# Altium schematic sheet 05 - Gate Drivers.SchDoc: Gate Drivers - 25kW WolfPACK FM3 Six-Pack Inv.
size 431 x 279 mm; Date: 09/2024; DocumentNumber: CRD25DA12N-FMC; Revision: 2.0; SheetNumber: 5; SheetTotal: 9; SheetSize: B
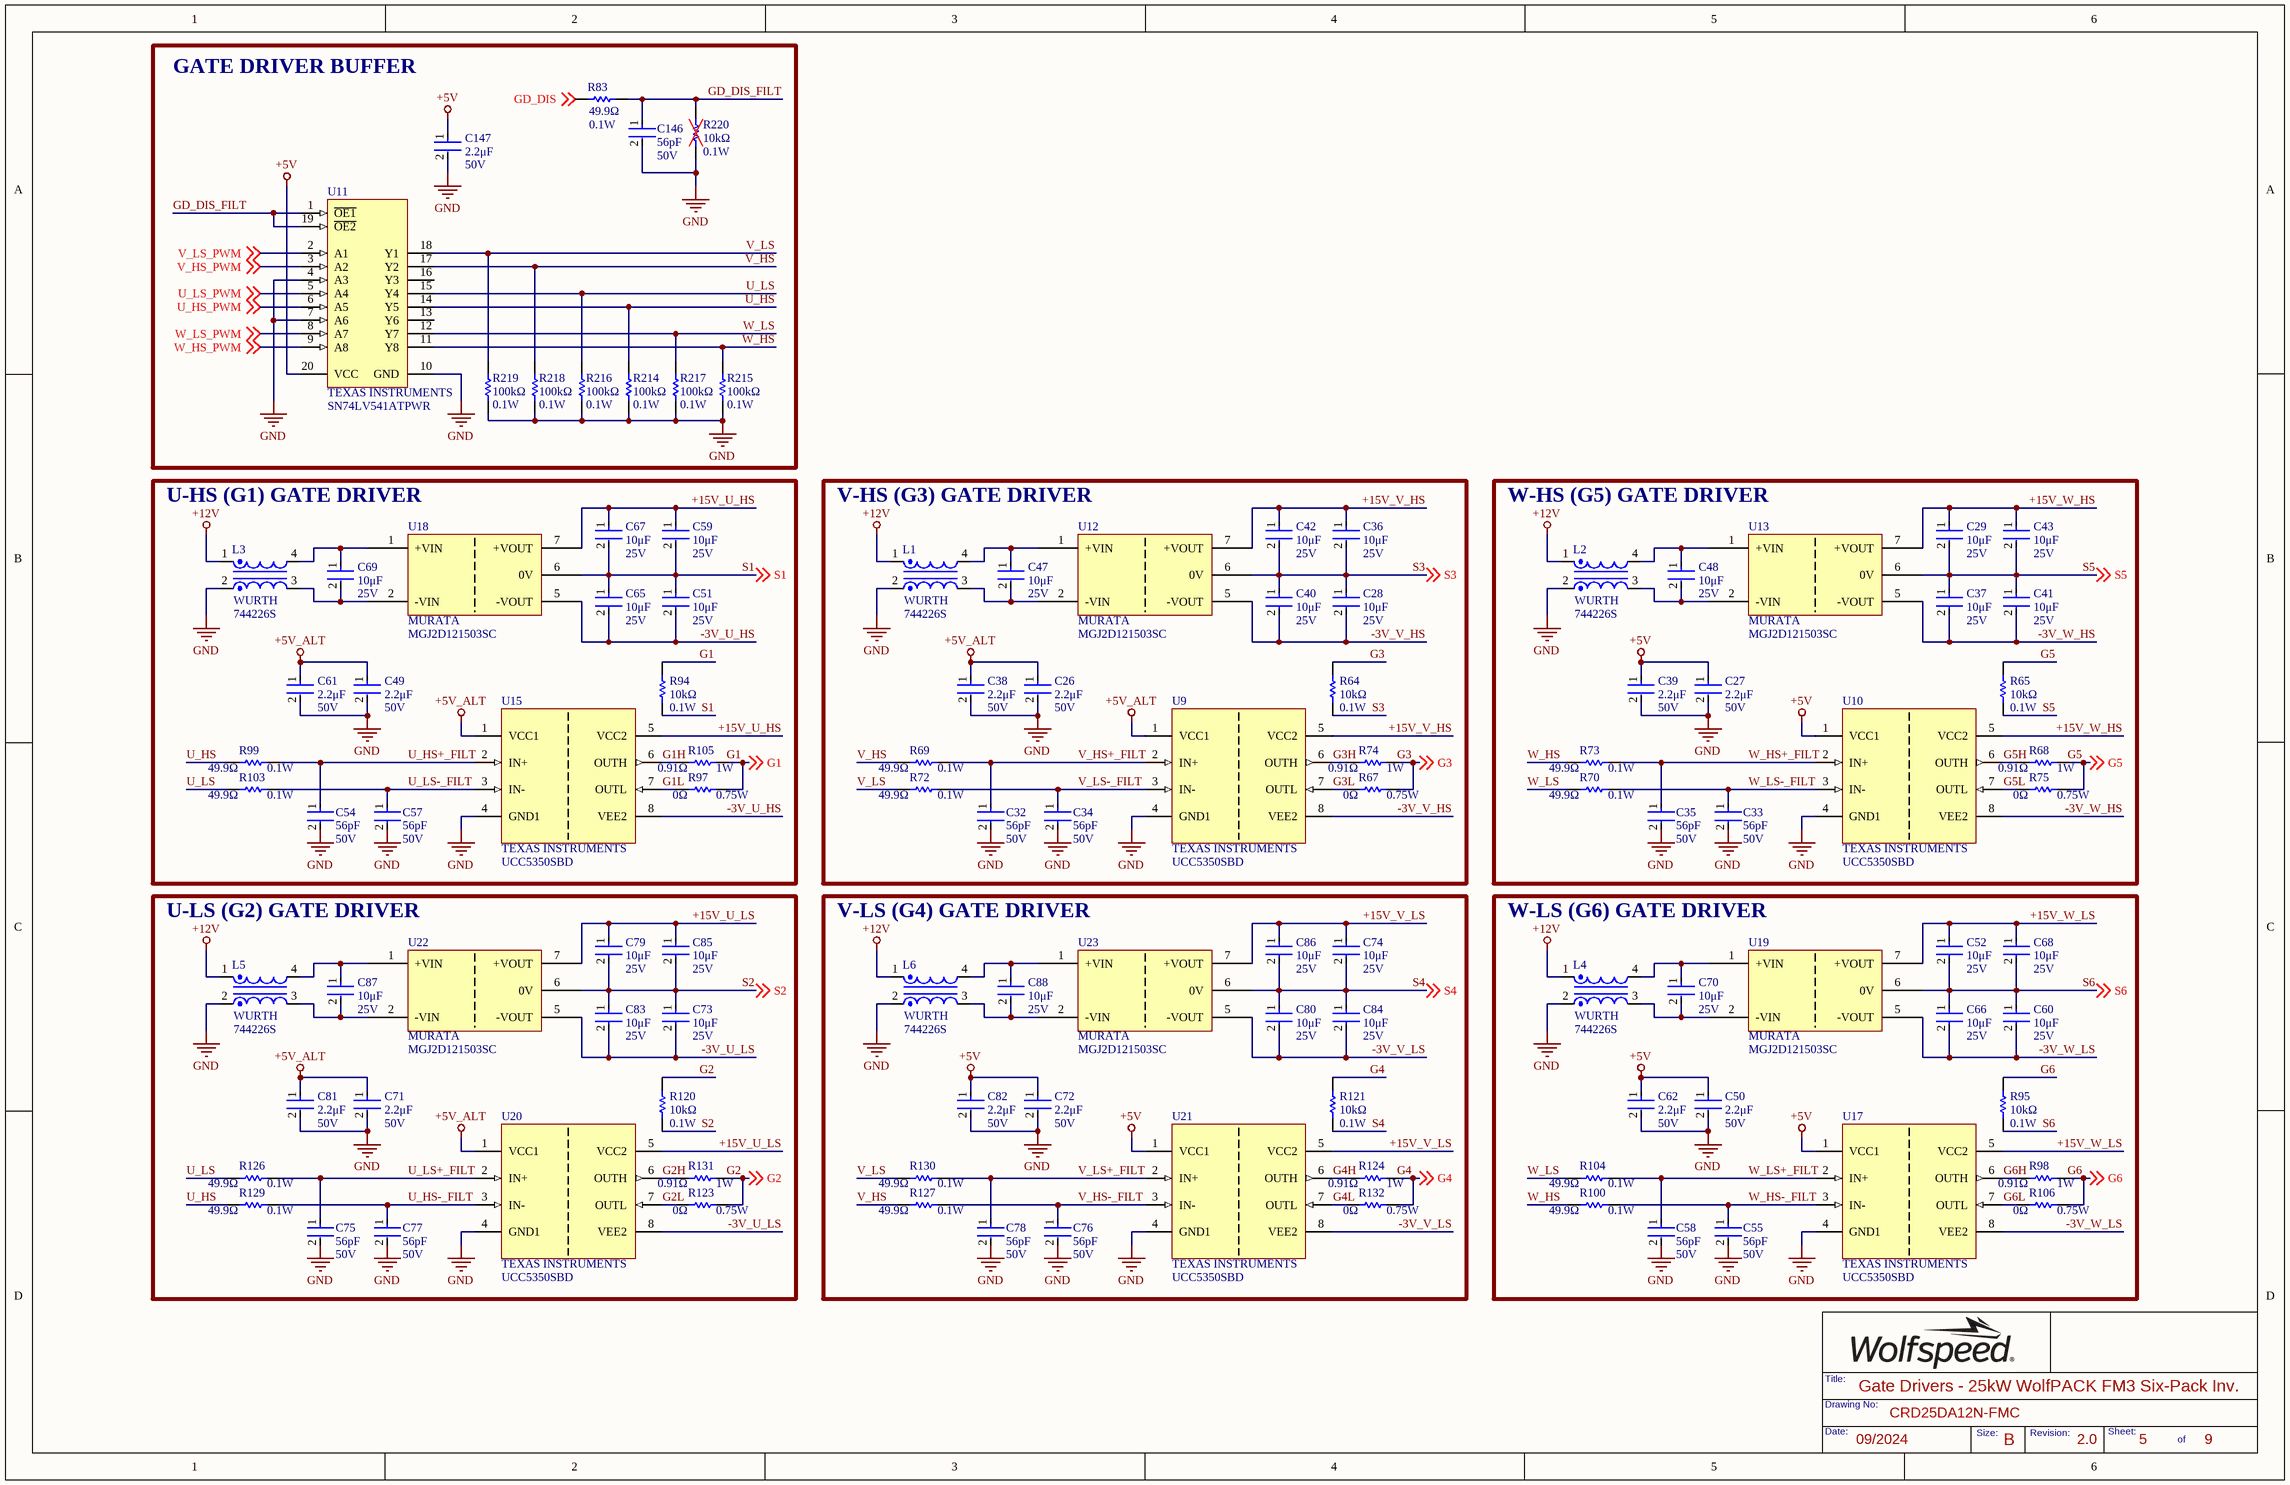
[diagram p0: 05 - Gate Drivers.SchDoc]

## Parts
C26  Voltage Rating: 50V  Capacitance: 2.2μF  [FP-C0603C-CF-IPC_B]  (hidden comment: GRT188R61H225ME13D)
C27  Voltage Rating: 50V  Capacitance: 2.2μF  [FP-C0603C-CF-IPC_B]  (hidden comment: GRT188R61H225ME13D)
C28  Voltage Rating: 25V  Capacitance: 10μF  [FP-CL31-IPC_B]  (hidden comment: CL31B106KAHSFNE)
C29  Voltage Rating: 25V  Capacitance: 10μF  [FP-CL31-IPC_B]  (hidden comment: CL31B106KAHSFNE)
C32  Capacitance: 56pF  Voltage Rating: 50V  [FP-C0603C-CF-IPC_B]  (hidden comment: CL10C560JB8NNNC)
C33  Capacitance: 56pF  Voltage Rating: 50V  [FP-C0603C-CF-IPC_B]  (hidden comment: CL10C560JB8NNNC)
C34  Capacitance: 56pF  Voltage Rating: 50V  [FP-C0603C-CF-IPC_B]  (hidden comment: CL10C560JB8NNNC)
C35  Capacitance: 56pF  Voltage Rating: 50V  [FP-C0603C-CF-IPC_B]  (hidden comment: CL10C560JB8NNNC)
C36  Voltage Rating: 25V  Capacitance: 10μF  [FP-CL31-IPC_B]  (hidden comment: CL31B106KAHSFNE)
C37  Voltage Rating: 25V  Capacitance: 10μF  [FP-CL31-IPC_B]  (hidden comment: CL31B106KAHSFNE)
C38  Voltage Rating: 50V  Capacitance: 2.2μF  [FP-C0603C-CF-IPC_B]  (hidden comment: GRT188R61H225ME13D)
C39  Voltage Rating: 50V  Capacitance: 2.2μF  [FP-C0603C-CF-IPC_B]  (hidden comment: GRT188R61H225ME13D)
C40  Voltage Rating: 25V  Capacitance: 10μF  [FP-CL31-IPC_B]  (hidden comment: CL31B106KAHSFNE)
C41  Voltage Rating: 25V  Capacitance: 10μF  [FP-CL31-IPC_B]  (hidden comment: CL31B106KAHSFNE)
C42  Voltage Rating: 25V  Capacitance: 10μF  [FP-CL31-IPC_B]  (hidden comment: CL31B106KAHSFNE)
C43  Voltage Rating: 25V  Capacitance: 10μF  [FP-CL31-IPC_B]  (hidden comment: CL31B106KAHSFNE)
C47  Voltage Rating: 25V  Capacitance: 10μF  [FP-CL31-IPC_B]  (hidden comment: CL31B106KAHSFNE)
C48  Voltage Rating: 25V  Capacitance: 10μF  [FP-CL31-IPC_B]  (hidden comment: CL31B106KAHSFNE)
C49  Voltage Rating: 50V  Capacitance: 2.2μF  [FP-C0603C-CF-IPC_B]  (hidden comment: GRT188R61H225ME13D)
C50  Voltage Rating: 50V  Capacitance: 2.2μF  [FP-C0603C-CF-IPC_B]  (hidden comment: GRT188R61H225ME13D)
C51  Voltage Rating: 25V  Capacitance: 10μF  [FP-CL31-IPC_B]  (hidden comment: CL31B106KAHSFNE)
C52  Voltage Rating: 25V  Capacitance: 10μF  [FP-CL31-IPC_B]  (hidden comment: CL31B106KAHSFNE)
C54  Capacitance: 56pF  Voltage Rating: 50V  [FP-C0603C-CF-IPC_B]  (hidden comment: CL10C560JB8NNNC)
C55  Capacitance: 56pF  Voltage Rating: 50V  [FP-C0603C-CF-IPC_B]  (hidden comment: CL10C560JB8NNNC)
C57  Capacitance: 56pF  Voltage Rating: 50V  [FP-C0603C-CF-IPC_B]  (hidden comment: CL10C560JB8NNNC)
C58  Capacitance: 56pF  Voltage Rating: 50V  [FP-C0603C-CF-IPC_B]  (hidden comment: CL10C560JB8NNNC)
C59  Voltage Rating: 25V  Capacitance: 10μF  [FP-CL31-IPC_B]  (hidden comment: CL31B106KAHSFNE)
C60  Voltage Rating: 25V  Capacitance: 10μF  [FP-CL31-IPC_B]  (hidden comment: CL31B106KAHSFNE)
C61  Voltage Rating: 50V  Capacitance: 2.2μF  [FP-C0603C-CF-IPC_B]  (hidden comment: GRT188R61H225ME13D)
C62  Voltage Rating: 50V  Capacitance: 2.2μF  [FP-C0603C-CF-IPC_B]  (hidden comment: GRT188R61H225ME13D)
C65  Voltage Rating: 25V  Capacitance: 10μF  [FP-CL31-IPC_B]  (hidden comment: CL31B106KAHSFNE)
C66  Voltage Rating: 25V  Capacitance: 10μF  [FP-CL31-IPC_B]  (hidden comment: CL31B106KAHSFNE)
C67  Voltage Rating: 25V  Capacitance: 10μF  [FP-CL31-IPC_B]  (hidden comment: CL31B106KAHSFNE)
C68  Voltage Rating: 25V  Capacitance: 10μF  [FP-CL31-IPC_B]  (hidden comment: CL31B106KAHSFNE)
C69  Voltage Rating: 25V  Capacitance: 10μF  [FP-CL31-IPC_B]  (hidden comment: CL31B106KAHSFNE)
C70  Voltage Rating: 25V  Capacitance: 10μF  [FP-CL31-IPC_B]  (hidden comment: CL31B106KAHSFNE)
C71  Voltage Rating: 50V  Capacitance: 2.2μF  [FP-C0603C-CF-IPC_B]  (hidden comment: GRT188R61H225ME13D)
C72  Voltage Rating: 50V  Capacitance: 2.2μF  [FP-C0603C-CF-IPC_B]  (hidden comment: GRT188R61H225ME13D)
C73  Voltage Rating: 25V  Capacitance: 10μF  [FP-CL31-IPC_B]  (hidden comment: CL31B106KAHSFNE)
C74  Voltage Rating: 25V  Capacitance: 10μF  [FP-CL31-IPC_B]  (hidden comment: CL31B106KAHSFNE)
C75  Capacitance: 56pF  Voltage Rating: 50V  [FP-C0603C-CF-IPC_B]  (hidden comment: CL10C560JB8NNNC)
C76  Capacitance: 56pF  Voltage Rating: 50V  [FP-C0603C-CF-IPC_B]  (hidden comment: CL10C560JB8NNNC)
C77  Capacitance: 56pF  Voltage Rating: 50V  [FP-C0603C-CF-IPC_B]  (hidden comment: CL10C560JB8NNNC)
C78  Capacitance: 56pF  Voltage Rating: 50V  [FP-C0603C-CF-IPC_B]  (hidden comment: CL10C560JB8NNNC)
C79  Voltage Rating: 25V  Capacitance: 10μF  [FP-CL31-IPC_B]  (hidden comment: CL31B106KAHSFNE)
C80  Voltage Rating: 25V  Capacitance: 10μF  [FP-CL31-IPC_B]  (hidden comment: CL31B106KAHSFNE)
C81  Voltage Rating: 50V  Capacitance: 2.2μF  [FP-C0603C-CF-IPC_B]  (hidden comment: GRT188R61H225ME13D)
C82  Voltage Rating: 50V  Capacitance: 2.2μF  [FP-C0603C-CF-IPC_B]  (hidden comment: GRT188R61H225ME13D)
C83  Voltage Rating: 25V  Capacitance: 10μF  [FP-CL31-IPC_B]  (hidden comment: CL31B106KAHSFNE)
C84  Voltage Rating: 25V  Capacitance: 10μF  [FP-CL31-IPC_B]  (hidden comment: CL31B106KAHSFNE)
C85  Voltage Rating: 25V  Capacitance: 10μF  [FP-CL31-IPC_B]  (hidden comment: CL31B106KAHSFNE)
C86  Voltage Rating: 25V  Capacitance: 10μF  [FP-CL31-IPC_B]  (hidden comment: CL31B106KAHSFNE)
C87  Voltage Rating: 25V  Capacitance: 10μF  [FP-CL31-IPC_B]  (hidden comment: CL31B106KAHSFNE)
C88  Voltage Rating: 25V  Capacitance: 10μF  [FP-CL31-IPC_B]  (hidden comment: CL31B106KAHSFNE)
C146  Capacitance: 56pF  Voltage Rating: 50V  [FP-C0603C-CF-IPC_B]  (hidden comment: CL10C560JB8NNNC)
C147  Voltage Rating: 50V  Capacitance: 2.2μF  [FP-C0603C-CF-IPC_B]  (hidden comment: GRT188R61H225ME13D)
L1  744226S  Manufacturer Print: WURTH  [WE-SL2]
L2  744226S  Manufacturer Print: WURTH  [WE-SL2]
L3  744226S  Manufacturer Print: WURTH  [WE-SL2]
L4  744226S  Manufacturer Print: WURTH  [WE-SL2]
L5  744226S  Manufacturer Print: WURTH  [WE-SL2]
L6  744226S  Manufacturer Print: WURTH  [WE-SL2]
R64  Resistance: 10kΩ  Max Power Dissipation: 0.1W  [FP-MCR03-IPC_B]  (hidden comment: ERJ3EKF1002V)
R65  Resistance: 10kΩ  Max Power Dissipation: 0.1W  [FP-MCR03-IPC_B]  (hidden comment: ERJ3EKF1002V)
R67  value 0Ω  Power Rating: 0.75W  [RESC3125X70X40NL20T20]  (hidden comment: CRCW12100000Z0EAHP)
R68  value 0.91Ω  Power: 1W  [RESC3125X70X40NL20T20]  (hidden comment: RCWE1210R910FKEA)
R69  Resistance: 49.9Ω  Power Rating: 0.1W  [FP-MCR03-IPC_B]  (hidden comment: ERJ-3EKF49R9V)
R70  Resistance: 49.9Ω  Power Rating: 0.1W  [FP-MCR03-IPC_B]  (hidden comment: ERJ-3EKF49R9V)
R72  Resistance: 49.9Ω  Power Rating: 0.1W  [FP-MCR03-IPC_B]  (hidden comment: ERJ-3EKF49R9V)
R73  Resistance: 49.9Ω  Power Rating: 0.1W  [FP-MCR03-IPC_B]  (hidden comment: ERJ-3EKF49R9V)
R74  value 0.91Ω  Power: 1W  [RESC3125X70X40NL20T20]  (hidden comment: RCWE1210R910FKEA)
R75  value 0Ω  Power Rating: 0.75W  [RESC3125X70X40NL20T20]  (hidden comment: CRCW12100000Z0EAHP)
R83  Resistance: 49.9Ω  Power Rating: 0.1W  [FP-MCR03-IPC_B]  (hidden comment: ERJ-3EKF49R9V)
R94  Resistance: 10kΩ  Max Power Dissipation: 0.1W  [FP-MCR03-IPC_B]  (hidden comment: ERJ3EKF1002V)
R95  Resistance: 10kΩ  Max Power Dissipation: 0.1W  [FP-MCR03-IPC_B]  (hidden comment: ERJ3EKF1002V)
R97  value 0Ω  Power Rating: 0.75W  [RESC3125X70X40NL20T20]  (hidden comment: CRCW12100000Z0EAHP)
R98  value 0.91Ω  Power: 1W  [RESC3125X70X40NL20T20]  (hidden comment: RCWE1210R910FKEA)
R99  Resistance: 49.9Ω  Power Rating: 0.1W  [FP-MCR03-IPC_B]  (hidden comment: ERJ-3EKF49R9V)
R100  Resistance: 49.9Ω  Power Rating: 0.1W  [FP-MCR03-IPC_B]  (hidden comment: ERJ-3EKF49R9V)
R103  Resistance: 49.9Ω  Power Rating: 0.1W  [FP-MCR03-IPC_B]  (hidden comment: ERJ-3EKF49R9V)
R104  Resistance: 49.9Ω  Power Rating: 0.1W  [FP-MCR03-IPC_B]  (hidden comment: ERJ-3EKF49R9V)
R105  value 0.91Ω  Power: 1W  [RESC3125X70X40NL20T20]  (hidden comment: RCWE1210R910FKEA)
R106  value 0Ω  Power Rating: 0.75W  [RESC3125X70X40NL20T20]  (hidden comment: CRCW12100000Z0EAHP)
R120  Resistance: 10kΩ  Max Power Dissipation: 0.1W  [FP-MCR03-IPC_B]  (hidden comment: ERJ3EKF1002V)
R121  Resistance: 10kΩ  Max Power Dissipation: 0.1W  [FP-MCR03-IPC_B]  (hidden comment: ERJ3EKF1002V)
R123  value 0Ω  Power Rating: 0.75W  [RESC3125X70X40NL20T20]  (hidden comment: CRCW12100000Z0EAHP)
R124  value 0.91Ω  Power: 1W  [RESC3125X70X40NL20T20]  (hidden comment: RCWE1210R910FKEA)
R126  Resistance: 49.9Ω  Power Rating: 0.1W  [FP-MCR03-IPC_B]  (hidden comment: ERJ-3EKF49R9V)
R127  Resistance: 49.9Ω  Power Rating: 0.1W  [FP-MCR03-IPC_B]  (hidden comment: ERJ-3EKF49R9V)
R129  Resistance: 49.9Ω  Power Rating: 0.1W  [FP-MCR03-IPC_B]  (hidden comment: ERJ-3EKF49R9V)
R130  Resistance: 49.9Ω  Power Rating: 0.1W  [FP-MCR03-IPC_B]  (hidden comment: ERJ-3EKF49R9V)
R131  value 0.91Ω  Power: 1W  [RESC3125X70X40NL20T20]  (hidden comment: RCWE1210R910FKEA)
R132  value 0Ω  Power Rating: 0.75W  [RESC3125X70X40NL20T20]  (hidden comment: CRCW12100000Z0EAHP)
R214  Resistance: 100kΩ  Power Rating: 0.1W  [FP-MCR03-IPC_B]  (hidden comment: RC0603FR-07100KL)
R215  Resistance: 100kΩ  Power Rating: 0.1W  [FP-MCR03-IPC_B]  (hidden comment: RC0603FR-07100KL)
R216  Resistance: 100kΩ  Power Rating: 0.1W  [FP-MCR03-IPC_B]  (hidden comment: RC0603FR-07100KL)
R217  Resistance: 100kΩ  Power Rating: 0.1W  [FP-MCR03-IPC_B]  (hidden comment: RC0603FR-07100KL)
R218  Resistance: 100kΩ  Power Rating: 0.1W  [FP-MCR03-IPC_B]  (hidden comment: RC0603FR-07100KL)
R219  Resistance: 100kΩ  Power Rating: 0.1W  [FP-MCR03-IPC_B]  (hidden comment: RC0603FR-07100KL)
R220  Resistance: 10kΩ  Max Power Dissipation: 0.1W  [FP-MCR03-IPC_B]  (hidden comment: ERJ3EKF1002V)
U9  UCC5350SBD  Manufacturer Print: TEXAS INSTRUMENTS  [D0008B_HV]
U10  UCC5350SBD  Manufacturer Print: TEXAS INSTRUMENTS  [D0008B_HV]
U11  Manufacturer: TEXAS INSTRUMENTS  [PW0020A_L]  (hidden comment: SN74LV541ATPWR)
U12  MGJ2D121503SC  Manufacturer Print: MURATA  [MGJ2D121509SC]
U13  MGJ2D121503SC  Manufacturer Print: MURATA  [MGJ2D121509SC]
U15  UCC5350SBD  Manufacturer Print: TEXAS INSTRUMENTS  [D0008B_HV]
U17  UCC5350SBD  Manufacturer Print: TEXAS INSTRUMENTS  [D0008B_HV]
U18  MGJ2D121503SC  Manufacturer Print: MURATA  [MGJ2D121509SC]
U19  MGJ2D121503SC  Manufacturer Print: MURATA  [MGJ2D121509SC]
U20  UCC5350SBD  Manufacturer Print: TEXAS INSTRUMENTS  [D0008B_HV]
U21  UCC5350SBD  Manufacturer Print: TEXAS INSTRUMENTS  [D0008B_HV]
U22  MGJ2D121503SC  Manufacturer Print: MURATA  [MGJ2D121509SC]
U23  MGJ2D121503SC  Manufacturer Print: MURATA  [MGJ2D121509SC]

## Blocks framed on the sheet
GATE DRIVER BUFFER: C146 C147 R83 R214-R220 U11
U-HS (G1) GATE DRIVER: C49 C51 C54 C57 C59 C61 C65 C67 C69 L3 R94 R97 R99 R103 R105 U15 U18
V-HS (G3) GATE DRIVER: C26 C28 C32 C34 C36 C38 C40 C42 C47 L1 R64 R67 R69 R72 R74 U9 U12
W-HS (G5) GATE DRIVER: C27 C29 C33 C35 C37 C39 C41 C43 C48 L2 R65 R68 R70 R73 R75 U10 U13
U-LS (G2) GATE DRIVER: C71 C73 C75 C77 C79 C81 C83 C85 C87 L5 R120 R123 R126 R129 R131 U20 U22
V-LS (G4) GATE DRIVER: C72 C74 C76 C78 C80 C82 C84 C86 C88 L6 R121 R124 R127 R130 R132 U21 U23
W-LS (G6) GATE DRIVER: C50 C52 C55 C58 C60 C62 C66 C68 C70 L4 R95 R98 R100 R104 R106 U17 U19

## Nets
+5V: C27.1 C39.1 C50.1 C62.1 C72.1 C82.1 C147.1 U10.1(VCC1) U11.20(VCC) U17.1(VCC1) U21.1(VCC1)
+5V_ALT: C26.1 C38.1 C49.1 C61.1 C71.1 C81.1 U9.1(VCC1) U15.1(VCC1) U20.1(VCC1)
+12V: L1.1 L2.1 L3.1 L4.1 L5.1 L6.1
GND: C26.2 C27.2 C32.2 C33.2 C34.2 C35.2 C38.2 C39.2 C49.2 C50.2 C54.2 C55.2 C57.2 C58.2 C61.2 C62.2 C71.2 C72.2 C75.2 C76.2 C77.2 C78.2 C81.2 C82.2 C146.2 C147.2 L1.2 L2.2 L3.2 L4.2 L5.2 L6.2 R214.1 R215.1 R216.1 R217.1 R218.1 R219.1 R220.1 U9.4(GND1) U10.4(GND1) U11.4(A3) U11.7(A6) U11.10(GND) U15.4(GND1) U17.4(GND1) U20.4(GND1) U21.4(GND1)
+15V_U_HS: C59.1 C67.1 U15.5(VCC2) U18.7(+VOUT)
+15V_U_LS: C79.1 C85.1 U20.5(VCC2) U22.7(+VOUT)
+15V_V_HS: C36.1 C42.1 U9.5(VCC2) U12.7(+VOUT)
+15V_V_LS: C74.1 C86.1 U21.5(VCC2) U23.7(+VOUT)
+15V_W_HS: C29.1 C43.1 U10.5(VCC2) U13.7(+VOUT)
+15V_W_LS: C52.1 C68.1 U17.5(VCC2) U19.7(+VOUT)
-3V_U_HS: C51.2 C65.2 U15.8(VEE2) U18.5(-VOUT)
-3V_U_LS: C73.2 C83.2 U20.8(VEE2) U22.5(-VOUT)
-3V_V_HS: C28.2 C40.2 U9.8(VEE2) U12.5(-VOUT)
-3V_V_LS: C80.2 C84.2 U21.8(VEE2) U23.5(-VOUT)
-3V_W_HS: C37.2 C41.2 U10.8(VEE2) U13.5(-VOUT)
-3V_W_LS: C60.2 C66.2 U17.8(VEE2) U19.5(-VOUT)
G1: R94.2 R97.2 R105.2 ; off-sheet G1
G1H: R105.1 U15.6(OUTH)
G1L: R97.1 U15.7(OUTL)
G2: R120.2 R123.2 R131.2 ; off-sheet G2
G2H: R131.1 U20.6(OUTH)
G2L: R123.1 U20.7(OUTL)
G3: R64.2 R67.2 R74.2 ; off-sheet G3
G3H: R74.1 U9.6(OUTH)
G3L: R67.1 U9.7(OUTL)
G4: R121.2 R124.2 R132.2 ; off-sheet G4
G4H: R124.1 U21.6(OUTH)
G4L: R132.1 U21.7(OUTL)
G5: R65.2 R68.2 R75.2 ; off-sheet G5
G5H: R68.1 U10.6(OUTH)
G5L: R75.1 U10.7(OUTL)
G6: R95.2 R98.2 R106.2 ; off-sheet G6
G6H: R98.1 U17.6(OUTH)
G6L: R106.1 U17.7(OUTL)
GD_DIS: R83.1 ; off-sheet GD_DIS
GD_DIS_FILT: C146.1 R83.2 R220.2 U11.1(~{OE1}) U11.19(~{OE2})
S1: C51.1 C59.2 C65.1 C67.2 R94.1 U18.6(0V) ; off-sheet S1
S2: C73.1 C79.2 C83.1 C85.2 R120.1 U22.6(0V) ; off-sheet S2
S3: C28.1 C36.2 C40.1 C42.2 R64.1 U12.6(0V) ; off-sheet S3
S4: C74.2 C80.1 C84.1 C86.2 R121.1 U23.6(0V) ; off-sheet S4
S5: C29.2 C37.1 C41.1 C43.2 R65.1 U13.6(0V) ; off-sheet S5
S6: C52.2 C60.1 C66.1 C68.2 R95.1 U19.6(0V) ; off-sheet S6
U_HS: R99.1 R129.1 R214.2 U11.14(Y5)
U_HS+_FILT: C54.1 R99.2 U15.2(IN+)
U_HS-_FILT: C77.1 R129.2 U20.3(IN-)
U_HS_PWM: U11.6(A5) ; off-sheet U_HS_PWM
U_LS: R103.1 R126.1 R216.2 U11.15(Y4)
U_LS+_FILT: C75.1 R126.2 U20.2(IN+)
U_LS-_FILT: C57.1 R103.2 U15.3(IN-)
U_LS_PWM: U11.5(A4) ; off-sheet U_LS_PWM
V_HS: R69.1 R127.1 R218.2 U11.17(Y2)
V_HS+_FILT: C32.1 R69.2 U9.2(IN+)
V_HS-_FILT: C76.1 R127.2 U21.3(IN-)
V_HS_PWM: U11.3(A2) ; off-sheet V_HS_PWM
V_LS: R72.1 R130.1 R219.2 U11.18(Y1)
V_LS+_FILT: C78.1 R130.2 U21.2(IN+)
V_LS-_FILT: C34.1 R72.2 U9.3(IN-)
V_LS_PWM: U11.2(A1) ; off-sheet V_LS_PWM
W_HS: R73.1 R100.1 R215.2 U11.11(Y8)
W_HS+_FILT: C35.1 R73.2 U10.2(IN+)
W_HS-_FILT: C55.1 R100.2 U17.3(IN-)
W_HS_PWM: U11.9(A8) ; off-sheet W_HS_PWM
W_LS: R70.1 R104.1 R217.2 U11.12(Y7)
W_LS+_FILT: C58.1 R104.2 U17.2(IN+)
W_LS-_FILT: C33.1 R70.2 U10.3(IN-)
W_LS_PWM: U11.8(A7) ; off-sheet W_LS_PWM
NetC47_1: C47.1 L1.4 U12.1(+VIN)
NetC47_2: C47.2 L1.3 U12.2(-VIN)
NetC48_1: C48.1 L2.4 U13.1(+VIN)
NetC48_2: C48.2 L2.3 U13.2(-VIN)
NetC69_1: C69.1 L3.4 U18.1(+VIN)
NetC69_2: C69.2 L3.3 U18.2(-VIN)
NetC70_1: C70.1 L4.4 U19.1(+VIN)
NetC70_2: C70.2 L4.3 U19.2(-VIN)
NetC87_1: C87.1 L5.4 U22.1(+VIN)
NetC87_2: C87.2 L5.3 U22.2(-VIN)
NetC88_1: C88.1 L6.4 U23.1(+VIN)
NetC88_2: C88.2 L6.3 U23.2(-VIN)

Not connected (* = marked no-connect by the designer): U11 13(Y6) 16(Y3)

## Notes on the sheet
- Title:
- Date:
- Drawing No:
- Size:
- Revision:
- Sheet:
- of

## Library data of the parts
C26 C27 C38 C39 C49 C50 C61 C62 C71 C72 C81 C82 C147 = GRT188R61H225ME13D: CAP CER 2.2UF 50V X5R 0603; Manufacturer: MURATA; Tolerance: 20%; Value: 2.2μF; Supplier 1: Arrow Electronics; Manufacturer Part Number: GRT188R61H225ME13D; RoHS: Yes; Category: Ceramic Capacitors; Stock 1: 3937; Pricing 1: 1=0.29580, 10=0.20370, 25=0.18090, 100=0.12380, 250=0.12190, 500=0.10920, 1000=0.07700, 3000=0.07630 (USD); Mount: Surface Mount; Case Code (Metric): 1608; Case Code (Imperial): 0603; Min Operating Temperature: -55°C; Max Operating Temperature: 85°C; Packaging: Tape and Reel; Length: 0.063inch; Width: 0.031inch; Thickness: 0.035inch; Ratings: AEC-Q200; RoHS Compliant: Yes; ComponentLink1URL: http://search.murata.co.jp/Ceramy/image/img/A01X/G101/ENG/GRT188R61H225ME13-01.pdf?src-supplier=Digi-Key; ComponentLink1Description: http://search.murata.co.jp/Ceramy/image/img/A01X/G101/ENG/GRT188R61H225ME13-01.pdf?src-supplier=Digi-Key; ComponentLink2URL: https://search.murata.co.jp/Ceramy/image/img/A01X/G101/ENG/GRT188R61H225ME13-01.pdf?src-supplier=Digi-Key; ComponentLink2Description: https://search.murata.co.jp/Ceramy/image/img/A01X/G101/ENG/GRT188R61H225ME13-01.pdf?src-supplier=Digi-Key; Supplier Part Number 1: GRT188R61H225ME13D; Package: 0603
C28 C29 C36 C37 C40-C43 C47 C48 C51 C52 C59 C60 C65-C70 C73 C74 C79 C80 C83-C88 = CMP-13271-001434-1: CAP CER 10UF 25V X7R 1206; Manufacturer: SAMSUNG; Tolerance: 10%; Value: 10μF; Max Operating Temperature: 125°C; Dielectric: X7R; Min Operating Temperature: -55°C; Height: 1.6mm; Mount: Surface Mount; Width: 0.063inch; Thickness: 0.071inch; Case Code (Metric): 3216; Contact Plating: Tin; Packaging: Tape and Reel; Package: 1206; Case Code (Imperial): 1206; Length: 0.126inch; Radiation Hardening: No; Package Quantity: 1; Depth: 1.6mm; Manufacturer Part Number: CL31B106KAHSFNE
C32-C35 C54 C55 C57 C58 C75-C78 C146 = CL10C560JB8NNNC: CAP CER 56PF 50V C0G/NP0 0603; Manufacturer: SAMSUNG; Material: Ceramic; Tolerance: 5%; Dielectric: C0G; Temperature Coefficient: 30ppm/°C; Supplier 1: Arrow Electronics; Manufacturer Part Number: CL10C560JB8NNNC; RoHS: Yes; Category: Ceramic Capacitors; Stock 1: 60182; Pricing 1: 1=0.05960, 10=0.01370, 25=0.01360, 100=0.01080, 250=0.01070, 500=0.00740, 1000=0.00590, 3000=0.00560, 6000=0.00530, 15000=0.00500, 30000=0.00470 (USD); Mount: Surface Mount; Case Code (Metric): 1608; Case Code (Imperial): 0603; Min Operating Temperature: -55°C; Max Operating Temperature: 125°C; Packaging: Tape and Reel; Package Quantity: 1; Voltage: 50V; Voltage Rating (DC): 50V; Series: CL; Construction: Flat; Termination: SMD/SMT; Length: 1.6mm; Width: 0.031inch; Height: 0.8mm; Thickness: 0.035inch; Depth: 0.8mm; Radiation Hardening: No; Lead Free: Lead Free; RoHS Compliant: Yes; ComponentLink1URL: https://datasheet.ciiva.com/25803/cl10c560jb8nnnc-25803592.pdf?src-supplier=Digi-Key; ComponentLink1Description: https://datasheet.ciiva.com/25803/cl10c560jb8nnnc-25803592.pdf?src-supplier=Digi-Key; ComponentLink2URL: https://datasheet.ciiva.com/26838/getdatasheetpartid-640760-26838546.pdf?src-supplier=Verical; ComponentLink2Description: https://datasheet.ciiva.com/26838/getdatasheetpartid-640760-26838546.pdf?src-supplier=Verical; ComponentLink3URL: https://datasheet.ciiva.com/29198/456837-da-01-en-vs-kondensator-0603-29198873.pdf?src-supplier=Conrad; ComponentLink3Description: https://datasheet.ciiva.com/29198/456837-da-01-en-vs-kondensator-0603-29198873.pdf?src-supplier=Conrad; ComponentLink4URL: https://datasheet.ciiva.com/48428/mlcc-catalogdownload2013-eng-48428598.pdf?src-supplier=Distrelec; ComponentLink4Description: https://datasheet.ciiva.com/48428/mlcc-catalogdownload2013-eng-48428598.pdf?src-supplier=Distrelec; ComponentLink5URL: https://datasheet.ciiva.com/16449/cl05b104kq5nnnc-16449527.pdf?src-supplier=Future+Electronics; ComponentLink5Description: https://datasheet.ciiva.com/16449/cl05b104kq5nnnc-16449527.pdf?src-supplier=Future+Electronics; Supplier Part Number 1: CL10C560JB8NNNC; Package: 0603; Value: 56pF
L1-L6 = 744226S: CMC 10UH 1.6A 2LN 920 OHM SMD; Manufacturer: WURTH ELECTRONIK; Tolerance: 30%; Voltage Rating: 80V; Resistance: 80mR; Impedance: 920R; Number of Lines: 2; Test Frequency: 1kHz; Value: 10μH; Supplier 1: Rs; Manufacturer Part Number: 744226S; RoHS: Yes; Category: Common Mode Chokes; Stock 1: 1; Pricing 1: 1=2.59000, 25=2.28200, 100=2.10000, 250=1.94000, 500=1.81400 (USD); Mount: Surface Mount; Case/Package: SMD/SMT; Weight: 0.017672oz; Min Operating Temperature: -40°C; Max Operating Temperature: 125°C; Packaging: Tape and Reel; Package Quantity: 1; Series: WE-SL2; Termination: SMD/SMT; Current Rating: 1.6A; Inductance: 10uH; Current: 1.6A; DC Resistance (DCR): 80mR; Max DC Current: 1.6A; Max Current Rating: 1.6A; Length: 9.2mm; Width: 6mm; Height: 0.205inch; Lead Free: Lead Free; RoHS Compliant: Yes; Reach SVHC Compliant: Yes; ComponentLink1URL: https://datasheet.ciiva.com/12378/744226s-67907-12378330.pdf?src-supplier=Mouser; ComponentLink1Description: https://datasheet.ciiva.com/12378/744226s-67907-12378330.pdf?src-supplier=Mouser; ComponentLink2URL: https://datasheet.ciiva.com/1008/744226s-1008438.pdf?src-supplier=Digi-Key; ComponentLink2Description: https://datasheet.ciiva.com/1008/744226s-1008438.pdf?src-supplier=Digi-Key; ComponentLink3URL: https://datasheet.ciiva.com/1126/1735584-1126949.pdf?src-supplier=Element14; ComponentLink3Description: https://datasheet.ciiva.com/1126/1735584-1126949.pdf?src-supplier=Element14; ComponentLink4URL: https://datasheet.ciiva.com/6868/1696373-6868167.pdf?src-supplier=Newark; ComponentLink4Description: https://datasheet.ciiva.com/6868/1696373-6868167.pdf?src-supplier=Newark; ComponentLink5URL: https://datasheet.ciiva.com/1008/744226s-1008439.pdf?src-supplier=Digi-Key; ComponentLink5Description: https://datasheet.ciiva.com/1008/744226s-1008439.pdf?src-supplier=Digi-Key; ComponentLink6URL: https://datasheet.ciiva.com/1008/744226s-1008440.pdf?src-supplier=Digi-Key; ComponentLink6Description: https://datasheet.ciiva.com/1008/744226s-1008440.pdf?src-supplier=Digi-Key; ComponentLink7URL: https://datasheet.ciiva.com/26308/744226s-eng-tds-26308764.pdf?src-supplier=Distrelec; ComponentLink7Description: https://datasheet.ciiva.com/26308/744226s-eng-tds-26308764.pdf?src-supplier=Distrelec; ComponentLink8URL: https://datasheet.ciiva.com/48691/001087362-da-01-ml-we-sl2-stromkomp-smd-line-filter-7-de-en-48691435.pdf?src-supplier=Conrad; ComponentLink8Description: https://datasheet.ciiva.com/48691/001087362-da-01-ml-we-sl2-stromkomp-smd-line-filter-7-de-en-48691435.pdf?src-supplier=Conrad; Supplier Part Number 1: 9040408; Package: 4-PC
R64 R65 R94 R95 R120 R121 R220 = ERJ3EKF1002V: RES SMD 10K OHM 1% 1/10W 0603; Manufacturer: PANASONIC; Manufacturer Part Number: ERJ-3EKF1002V; Temperature Coefficient: 100ppm/°C; Power Rating: 100mW; Voltage Rating: 75V; Value: 10kΩ; Supplier 1: Rs; RoHS: Yes; Category: Chip SMD Resistors; Stock 1: 10000; Mount: Surface Mount; Package: 0603; Number of Pins: 2; Contact Plating: Tin; Case Code (Metric): 1608; Case Code (Imperial): 0603; Size Code: 0603; Min Operating Temperature: -55°C; Max Operating Temperature: 155°C; Tolerance: 1%; Resistor Type: Thick Film; Packaging: Tape and Reel; Package Quantity: 1; Number of Terminations: 2; Termination: SMD/SMT; Voltage Rating (DC): 75V; Features: Automotive AEC-Q200; Series: ERJ; Technology: THICK FILM; Resistance Tolerance: 1%; Construction: Rectangular; Length: 1.6mm; Width: 0.8mm; Height: 0.45mm; Depth: 0.8mm; Radiation Hardening: No; Reach SVHC Compliant: Yes; Military Standard: Not; Lead Free: Lead Free; RoHS Compliant: Yes; ComponentLink1URL: https://datasheet.ciiva.com/7830/aoa0000ce2-7830729.pdf?src-supplier=Element14; ComponentLink1Description: https://datasheet.ciiva.com/7830/aoa0000ce2-7830729.pdf?src-supplier=Element14; ComponentLink2URL: https://datasheet.ciiva.com/46372/1678782-46372725.pdf?src-supplier=Element14; ComponentLink2Description: https://datasheet.ciiva.com/46372/1678782-46372725.pdf?src-supplier=Element14; ComponentLink3URL: https://datasheet.ciiva.com/28514/426256-28514198.pdf?src-supplier=Element14; ComponentLink3Description: https://datasheet.ciiva.com/28514/426256-28514198.pdf?src-supplier=Element14; ComponentLink4URL: https://datasheet.ciiva.com/24070/aoa0000ce2-24070318.pdf?src-supplier=Mouser; ComponentLink4Description: https://datasheet.ciiva.com/24070/aoa0000ce2-24070318.pdf?src-supplier=Mouser; ComponentLink5URL: https://datasheet.ciiva.com/16759/70260748-16759807.pdf?src-supplier=Allied+Electronics; ComponentLink5Description: https://datasheet.ciiva.com/16759/70260748-16759807.pdf?src-supplier=Allied+Electronics; ComponentLink6URL: https://datasheet.ciiva.com/9194/aoa0000ce2-9194199.pdf?src-supplier=Avnet; ComponentLink6Description: https://datasheet.ciiva.com/9194/aoa0000ce2-9194199.pdf?src-supplier=Avnet; ComponentLink7URL: https://datasheet.ciiva.com/48530/aoa0000ce2-48530988.pdf?src-supplier=Avnet; ComponentLink7Description: https://datasheet.ciiva.com/48530/aoa0000ce2-48530988.pdf?src-supplier=Avnet; ComponentLink8URL: https://datasheet.ciiva.com/30208/aoa0000ce2-30208985.pdf?src-supplier=Onlinecomponents.com; ComponentLink8Description: https://datasheet.ciiva.com/30208/aoa0000ce2-30208985.pdf?src-supplier=Onlinecomponents.com; Supplier Part Number 1: 1051156
R67 R75 R97 R106 R123 R132 = CRCW12100000Z0EAHP: RES SMD 0 OHM JUMPER 3/4W 1210; Manufacturer: VISHAY DALE; Max Power Dissipation: 750mW; Supplier 1: Mouser; Manufacturer Part Number: CRCW12100000Z0EAHP; RoHS: Yes; Category: Chip SMD Resistors; Stock 1: 904; Pricing 1: 1=0.7, 10=0.535, 50=0.535, 100=0.225, 1000=0.135, 10000=0.134 (USD); Package: 1210; Weight: 0.000564oz; Case Code (Imperial): 1210; Case Code (Metric): 3225; Min Operating Temperature: -55°C; Max Operating Temperature: 155°C; Packaging: Tape and Reel; Package Quantity: 10; Resistance: 0Ω; Termination: SMD/SMT; Number of Terminations: 2; Features: Automotive AEC-Q200; Series: CRCW-HP; Length: 0.126inch; Width: 0.098inch; Height: 0.028inch; Radiation Hardening: No; Lead Free: Lead Free; RoHS Compliant: Yes; ComponentLink1URL: https://datasheet.ciiva.com/2477/crcwhpe3-2477993.pdf?src-supplier=Digi-Key; ComponentLink1Description: https://datasheet.ciiva.com/2477/crcwhpe3-2477993.pdf?src-supplier=Digi-Key; ComponentLink2URL: https://datasheet.ciiva.com/2477/crcwhpe3-2477991.pdf?src-supplier=Digi-Key; ComponentLink2Description: https://datasheet.ciiva.com/2477/crcwhpe3-2477991.pdf?src-supplier=Digi-Key; ComponentLink3URL: https://datasheet.ciiva.com/2477/crcwhpe3-2477992.pdf?src-supplier=Digi-Key; ComponentLink3Description: https://datasheet.ciiva.com/2477/crcwhpe3-2477992.pdf?src-supplier=Digi-Key; ComponentLink4URL: https://datasheet.ciiva.com/9109/crcwhpe3-9109997.pdf?src-supplier=Avnet; ComponentLink4Description: https://datasheet.ciiva.com/9109/crcwhpe3-9109997.pdf?src-supplier=Avnet; ComponentLink5URL: https://datasheet.ciiva.com/48527/crcwhpe3-48527662.pdf?src-supplier=Avnet; ComponentLink5Description: https://datasheet.ciiva.com/48527/crcwhpe3-48527662.pdf?src-supplier=Avnet; Supplier Part Number 1: 71-CRCW12100000Z0EAH
R68 R74 R98 R105 R124 R131 = CMP-2005-02198-1: RES 0.91 OHM 1% 1W 1210; Manufacturer: VISHAY DALE; Part Number: RCWE1210R910FKEA; Manufacturer Part Number: RCWE1210R910FKEA; Package: 1210
R69 R70 R72 R73 R83 R99 R100 R103 R104 R126 R127 R129 R130 = ERJ-3EKF49R9V: RES SMD 49.9 OHM 1% 1/10W 0603; Manufacturer: PANASONIC; Temperature Coefficient: 100ppm/°C; Voltage Rating: 75V; Max Power Dissipation: 100mW; Voltage Rating (DC): 50V; Working Voltage: 6V; Value: 49.9Ω; Supplier 1: Newark; Manufacturer Part Number: ERJ-3EKF49R9V; RoHS: Yes; Category: Chip SMD Resistors; Stock 1: 670000; Pricing 1: 1=0.00600, 5000=0.00600 (USD); Mount: Surface Mount; Contact Plating: Tin; Case Code (Imperial): 0603; Case Code (Metric): 1608; Min Operating Temperature: -55°C; Max Operating Temperature: 155°C; Tolerance: 1%; Resistor Type: Thick Film; Packaging: Tape and Reel; Package Quantity: 5000; Number of Terminations: 2; Termination: SMD/SMT; Features: Automotive AEC-Q200; Series: ERJ; Resistance Tolerance: 1%; Construction: Rectangular; Technology: THICK FILM; Length: 1.6mm; Width: 0.8mm; Height: 0.022inch; Depth: 0.8mm; Radiation Hardening: No; Reach SVHC Compliant: Yes; Military Standard: Not; Lead Free: Lead Free; RoHS Compliant: Yes; ComponentLink1URL: https://datasheet.ciiva.com/46388/1678782-46388908.pdf?src-supplier=Element14; ComponentLink1Description: https://datasheet.ciiva.com/46388/1678782-46388908.pdf?src-supplier=Element14; ComponentLink2URL: https://datasheet.ciiva.com/28694/1678782-28694219.pdf?src-supplier=Element14; ComponentLink2Description: https://datasheet.ciiva.com/28694/1678782-28694219.pdf?src-supplier=Element14; ComponentLink3URL: https://datasheet.ciiva.com/16772/70260748-16772570.pdf?src-supplier=Allied+Electronics; ComponentLink3Description: https://datasheet.ciiva.com/16772/70260748-16772570.pdf?src-supplier=Allied+Electronics; ComponentLink4URL: https://datasheet.ciiva.com/16766/70260748-16766262.pdf?src-supplier=Allied+Electronics; ComponentLink4Description: https://datasheet.ciiva.com/16766/70260748-16766262.pdf?src-supplier=Allied+Electronics; ComponentLink5URL: https://datasheet.ciiva.com/9117/aoa0000ce2-9117128.pdf?src-supplier=Avnet; ComponentLink5Description: https://datasheet.ciiva.com/9117/aoa0000ce2-9117128.pdf?src-supplier=Avnet; ComponentLink6URL: https://datasheet.ciiva.com/48531/aoa0000ce2-48531019.pdf?src-supplier=Avnet; ComponentLink6Description: https://datasheet.ciiva.com/48531/aoa0000ce2-48531019.pdf?src-supplier=Avnet; ComponentLink7URL: https://datasheet.ciiva.com/30095/aoa0000ce2-30095355.pdf?src-supplier=Onlinecomponents.com; ComponentLink7Description: https://datasheet.ciiva.com/30095/aoa0000ce2-30095355.pdf?src-supplier=Onlinecomponents.com; Supplier Part Number 1: 12AC1058; Package: 0603
R214-R219 = RC0603FR-07100KL: RES 100K OHM 1% 1/10W 0603; Manufacturer: YAGEO; Temperature Coefficient: 100ppm/°C; Voltage Rating: 50V; Working Voltage: 75V; Max Power Dissipation: 100mW; Value: 100kΩ; Supplier 1: Future Electronics; Manufacturer Part Number: RC0603FR-07100KL; RoHS: Yes; Category: Chip SMD Resistors; Stock 1: 39805000; Pricing 1: 5000=0.00150, 50000=0.00140, 200000=0.00140, 625000=0.00130, 2000000=0.00120 (USD); Package: 0603; Number of Pins: 2; Case Code (Imperial): 0603; Case Code (Metric): 1608; Min Operating Temperature: -55°C; Max Operating Temperature: 155°C; Tolerance: 1%; Resistor Type: Thick Film; Voltage Rating (DC): 50V; Packaging: Tape and Reel; Termination: SMD/SMT; Number of Terminations: 2; Features: Moisture Resistant; Series: RC; Resistance Tolerance: 1%; Construction: Rectangular; Technology: THICK FILM; Length: 1.6mm; Width: 0.8mm; Height: 0.45mm; Depth: 0.8mm; Reach SVHC Compliant: Yes; Military Standard: Not; Lead Free: Lead Free; RoHS Compliant: Yes; ComponentLink1URL: https://datasheet.ciiva.com/11808/0900766b80f96399-11808107.pdf?src-supplier=Rs; ComponentLink1Description: https://datasheet.ciiva.com/11808/0900766b80f96399-11808107.pdf?src-supplier=Rs; ComponentLink2URL: https://datasheet.ciiva.com/7983/443971-7983593.pdf?src-supplier=Element14; ComponentLink2Description: https://datasheet.ciiva.com/7983/443971-7983593.pdf?src-supplier=Element14; ComponentLink3URL: https://datasheet.ciiva.com/22747/443971-22747516.pdf?src-supplier=Element14; ComponentLink3Description: https://datasheet.ciiva.com/22747/443971-22747516.pdf?src-supplier=Element14; ComponentLink4URL: https://datasheet.ciiva.com/46440/1868787-46440889.pdf?src-supplier=Element14; ComponentLink4Description: https://datasheet.ciiva.com/46440/1868787-46440889.pdf?src-supplier=Element14; ComponentLink5URL: https://datasheet.ciiva.com/7746/1738695-7746235.pdf?src-supplier=Element14; ComponentLink5Description: https://datasheet.ciiva.com/7746/1738695-7746235.pdf?src-supplier=Element14; ComponentLink6URL: https://datasheet.ciiva.com/7746/1738695-7746234.pdf?src-supplier=Element14; ComponentLink6Description: https://datasheet.ciiva.com/7746/1738695-7746234.pdf?src-supplier=Element14; Supplier Part Number 1: 3697448
U9 U10 U15 U17 U20 U21 = UCC5350SBD: 5A/5A, 3-KVRMS SINGLE-CHANNEL IS; Class: U; Working Voltage: 990V; Number of Channels: 1; Type: DEV; RefDes: RefDes; Copyright: Copyright (C) 2021 Ultra Librarian. All rights reserved.; Mfr_Name: Texas Instruments; Manufacturer_Part_Number: UCC5350SBD; Digi-Key_Part_Number_1: 296-47508-ND; Supplier 1: Digi-Key; Manufacturer: TEXAS INSTRUMENTS; Manufacturer Part Number: UCC5350SBD; RoHS: Yes; Category: Integrated Circuits (ICs); Stock 1: 1; Pricing 1: 1=3.15000, 10=2.83100, 25=2.67600, 100=2.31920, 250=2.20024, 500=1.97428, 1000=1.68300 (USD); Min Operating Temperature: -40°C; Max Operating Temperature: 125°C; RoHS Compliant: Yes; ComponentLink1URL: http://www.ti.com/lit/ds/symlink/ucc5350sb.pdf?src-supplier=Farnell; ComponentLink1Description: http://www.ti.com/lit/ds/symlink/ucc5350sb.pdf?src-supplier=Farnell; ComponentLink2URL: http://www.ti.com/lit/ds/symlink/ucc5350.pdf?src-supplier=Digi-Key; ComponentLink2Description: http://www.ti.com/lit/ds/symlink/ucc5350.pdf?src-supplier=Digi-Key; Supplier Part Number 1: 296-47508-ND; Package: 8-SOIC; Value: N/A
U11 = CMP-0440-01163-3: IC BUF NON-INVERT 5.5V 20TSSOP; Bits(#): 8; Voltage(Nom)(V): 5; ICC @ Nom Voltage(Max)(mA): 0.02; VCC(Max)(V): 5.5; Output Type: CMOS; Rating: Catalog; Input Type: TTL; VCC(Min)(V): 4.5; F @ Nom Voltage(Max)(Mhz): 110; tpd @ Nom Voltage(Max)(ns): 7.9; Code_JEDEC: MO-153; PackageReference: PW0020A; DatasheetVersion: SCES573B; Generic Part Number: SN74LV541AT; Operating Temperature Range(C): -40 to 125; PackageVersion: http://www.ti.com/lit/ml/mpds362/mpds362.pdf; Package: 20-TSSOP; Value: N/A; Manufacturer Part Number: SN74LV541ATPWR
U12 U13 U18 U19 U22 U23 = MGJ2D121503SC: DC DC CONVERTER 15V -3V 1.7W; Supplier 1: Mouser; Manufacturer: MURATA; Manufacturer Part Number: MGJ2D121503SC; RoHS: Yes; Category: Board Mount Modules; Stock 1: 14; Pricing 1: 1=8.68000, 10=8.68000, 50=8.67000, 100=8.33000, 1000=8.00000, 10000=8.00000 (USD); Supplier Part Number 1: 580-MGJ2D121503SC; Value: N/A; Package: 7-SIP